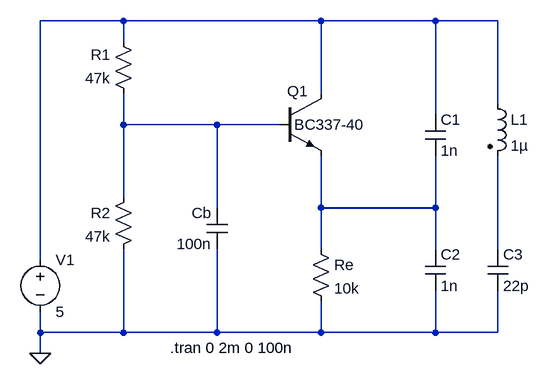
[diagram p0: schematic Draft4.asc]
Draft4.asc, the LTspice schematic file:
Version 4
SHEET 1 880 680
WIRE 16 16 -112 16
WIRE 320 16 16 16
WIRE 496 16 320 16
WIRE 592 16 496 16
WIRE 16 48 16 16
WIRE 320 128 320 16
WIRE 592 144 592 16
WIRE 496 160 496 16
WIRE 16 176 16 128
WIRE 160 176 16 176
WIRE 256 176 160 176
WIRE 16 288 16 176
WIRE 160 304 160 176
WIRE 320 304 320 224
WIRE 496 304 496 224
WIRE 496 304 320 304
WIRE 320 368 320 304
WIRE 496 368 496 304
WIRE 592 368 592 224
WIRE -112 384 -112 16
WIRE -112 496 -112 464
WIRE 16 496 16 368
WIRE 16 496 -112 496
WIRE 160 496 160 368
WIRE 160 496 16 496
WIRE 320 496 320 448
WIRE 320 496 160 496
WIRE 496 496 496 432
WIRE 496 496 320 496
WIRE 592 496 592 432
WIRE 592 496 496 496
WIRE -112 528 -112 496
FLAG -112 528 0
SYMBOL ind2 576 128 R0
SYMATTR InstName L1
SYMATTR Value 1µ
SYMATTR Type ind
SYMBOL cap 176 368 R180
WINDOW 0 24 56 Left 2
WINDOW 3 24 8 Left 2
SYMATTR InstName Cb
SYMATTR Value 100n
SYMBOL cap 576 368 R0
SYMATTR InstName C3
SYMATTR Value 22p
SYMBOL cap 480 368 R0
SYMATTR InstName C2
SYMATTR Value 1n
SYMBOL res 304 352 R0
SYMATTR InstName Re
SYMATTR Value 10k
SYMBOL res 32 144 R180
WINDOW 0 36 76 Left 2
WINDOW 3 36 40 Left 2
SYMATTR InstName R1
SYMATTR Value 47k
SYMBOL npn 256 128 R0
WINDOW 0 12 -4 Left 2
WINDOW 3 23 48 Left 2
SYMATTR InstName Q1
SYMATTR Value BC337-40
SYMBOL voltage -112 368 R0
WINDOW 123 0 0 Left 2
WINDOW 39 0 0 Left 2
SYMATTR InstName V1
SYMATTR Value 5
SYMBOL cap 480 160 R0
SYMATTR InstName C1
SYMATTR Value 1n
SYMBOL res 32 272 M0
SYMATTR InstName R2
SYMATTR Value 47k
TEXT 88 520 Left 2 !.tran 0 2m 0 100n

The netlist it stands for:
* Draft4.asc
L1 N001 N004 1µ
Cb 0 N002 100n
C3 N004 0 22p
C2 N003 0 1n
Re N003 0 10k
R1 N002 N001 47k
Q1 N001 N002 N003 0 BC337-40
V1 N001 0 5
C1 N001 N003 1n
R2 N002 0 47k
.model NPN NPN
.model PNP PNP
.lib standard.bjt
.tran 0 2m 0 100n
.backanno
.end